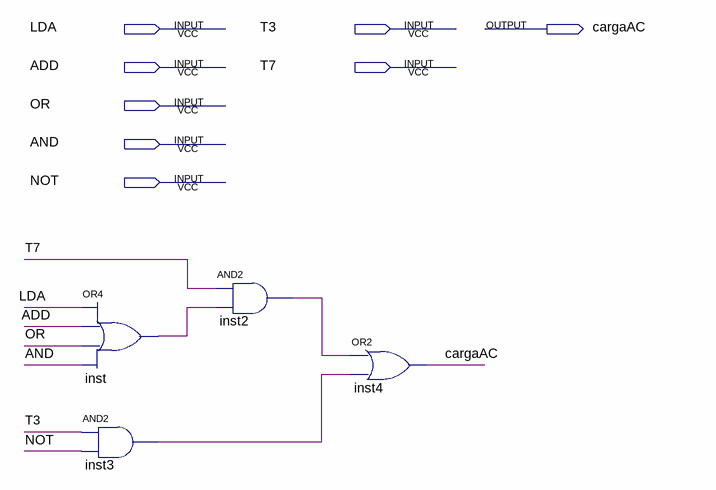
[diagram p0: schematic sheet]
// Quartus schematic cargaAC.bdf as structural Verilog: 4 symbols, 8 pins
module cargaAC (
  input  LDA,
  input  T3,
  input  ADD,
  input  T7,
  input  OR,
  input  AND,
  input  NOT,
  output cargaAC
);

  wire inst2_out, inst3_out, inst_out;

  or inst (inst_out, LDA, ADD, OR, AND);
  and inst3 (inst3_out, T3, NOT);
  and inst2 (inst2_out, T7, inst_out);
  or inst4 (cargaAC, inst2_out, inst3_out);
endmodule
